# EasyEDA schematic SCH_AquaMind_2026-07-25.json
TITLE: Sheet_1; REV: 1.0; Date: 2026-07-24; Sheet: 1/1; Company: Your Company
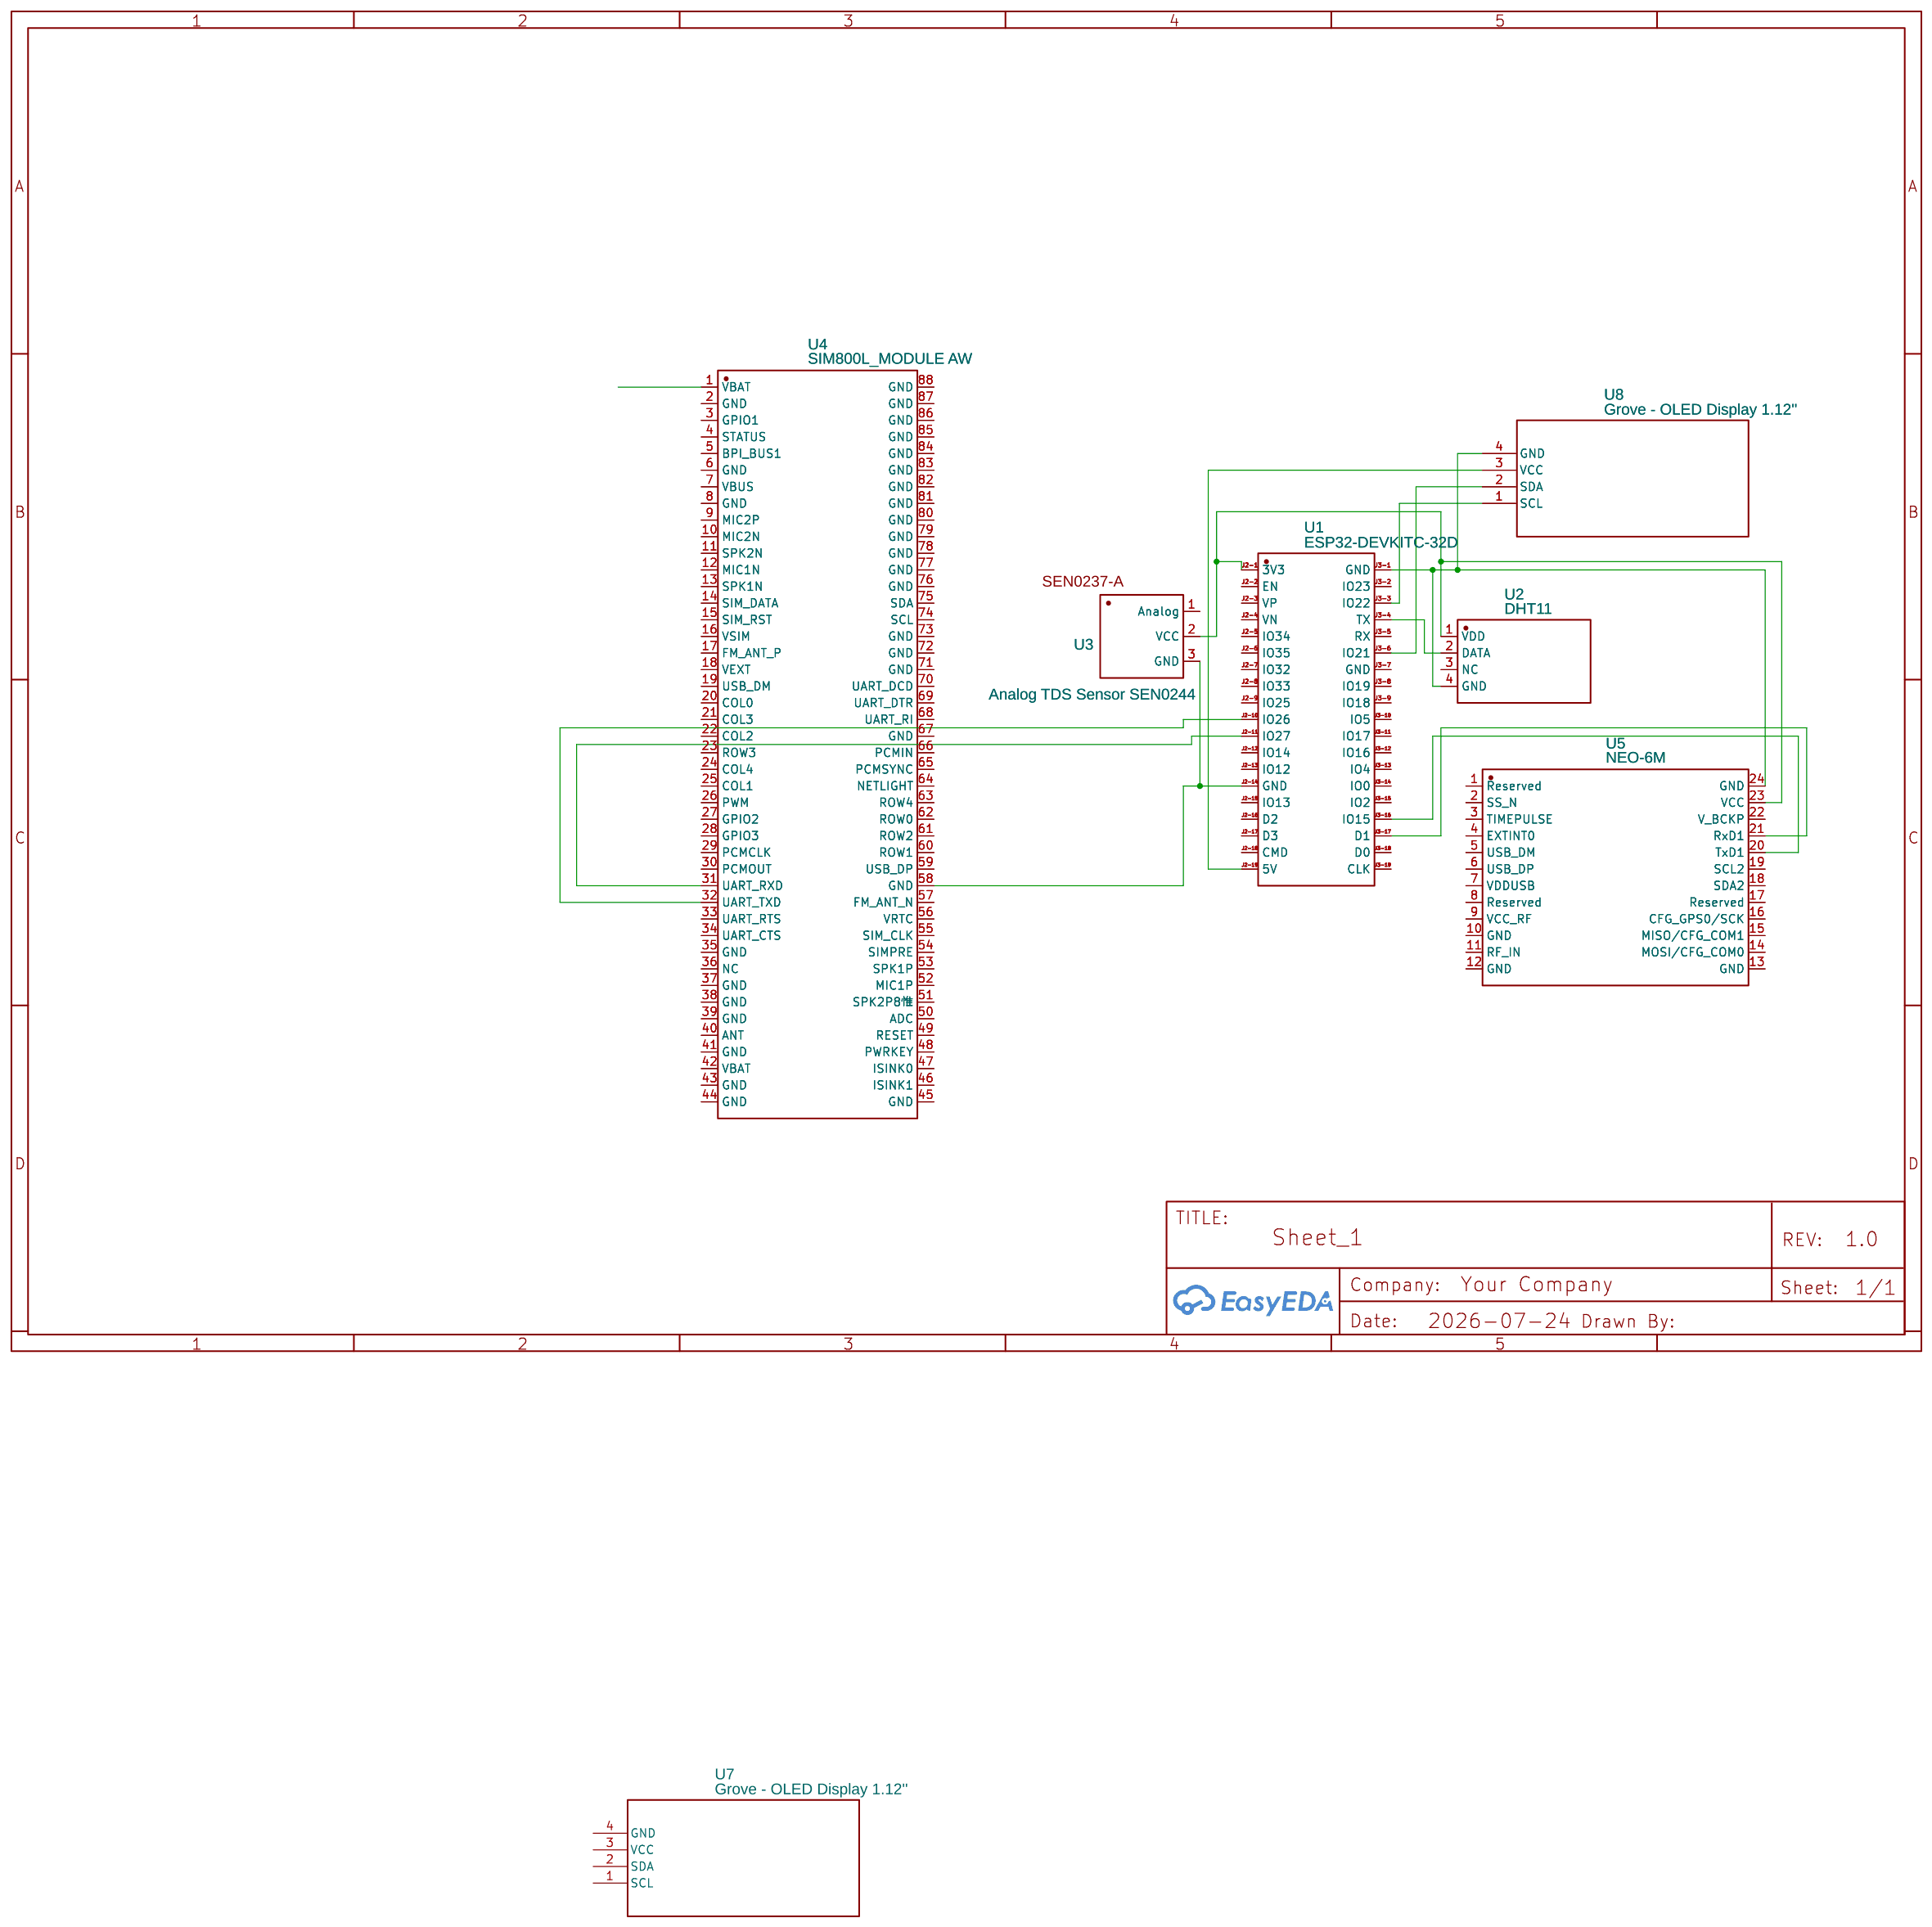
[diagram p0: schematic sheet]

## Parts
U1  ESP32-DEVKITC-32D  [COMM-SMD_ESP32-DEVKITC-32D]
U2  DHT11  [SENSOR-TH_DHT11]
U3  Analog TDS Sensor SEN0244
U4  SIM800L_MODULE AW  [GSMM-SMD_SIM800L]
U5  NEO-6M  [GPSM-SMD_24P-L16.0-W12.2-P1.10]
U7  Grove - OLED Display 1.12''  [GROVE - OLED DISPLAY 1.12'']
U8  Grove - OLED Display 1.12''  [GROVE - OLED DISPLAY 1.12'']

## Library data of the parts
U1 = ESP32-DEVKITC-32D: Supplier: LCSC; Supplier Part: C571181; Manufacturer: ESPRESSIF(乐鑫); Manufacturer Part: ESP32-DevKitC-32D; Contributor: lcsc
U2 = DHT11: Contributor: LCSC; Supplier: LCSC; Supplier Part: C117051; Manufacturer: 广州奥松; JLCPCB Part Class: Extended Part
U3 = Analog TDS Sensor SEN0244: Contributor: scholliyt
U4 = SIM800L_MODULE AW: Supplier: LCSC; Supplier Part: C9900051054; Manufacturer: null; JLCPCB Part Class: Extended Part; Contributor: lcsc
U5 = NEO-6M: Contributor: LCSC; Supplier: LCSC; Supplier Part: C2927633; Manufacturer: null; JLCPCB Part Class: Extended Part
U7 U8 = Grove - OLED Display 1.12'': sourceId: X2WQ82kCU; Supplier Part: undefined; Supplier: SeeedStudio

## Nets
Net-(U1-J2-1): U1.J2-1(3V3) U2.1(VDD) U3.2(VCC) U5.23(VCC)
Net-(U1-J2-10): U1.J2-10(IO26) U4.32(UART_TXD)
Net-(U1-J2-11): U1.J2-11(IO27) U4.31(UART_RXD)
Net-(U1-J2-14): U1.J2-14(GND) U3.3(GND) U4.58(GND)
Net-(U1-J2-19): U1.J2-19(5V) U8.3(VCC)
Net-(U1-J3-1): U1.J3-1(GND) U2.4(GND) U5.24(GND) U8.4(GND)
Net-(U1-J3-3): U1.J3-3(IO22) U8.1(SCL)
Net-(U1-J3-4): U1.J3-4(TX) U2.2(DATA)
Net-(U1-J3-6): U1.J3-6(IO21) U8.2(SDA)
Net-(U1-J3-16): U1.J3-16(IO15) U5.20(TxD1)
Net-(U1-J3-17): U1.J3-17(D1) U5.21(RxD1)

Not connected (* = marked no-connect by the designer): U1 J2-2(EN) J2-3(VP) J2-4(VN) J2-5(IO34) J2-6(IO35) J2-7(IO32) J2-8(IO33) J2-9(IO25) J2-12(IO14) J2-13(IO12) J2-15(IO13) J2-16(D2) J2-17(D3) J2-18(CMD) J3-2(IO23) J3-5(RX) J3-7(GND) J3-8(IO19) J3-9(IO18) J3-10(IO5) J3-11(IO17) J3-12(IO16) J3-13(IO4) J3-14(IO0) J3-15(IO2) J3-18(D0) J3-19(CLK); U2 3(NC); U3 1(Analog); U4 1(VBAT) 2(GND) 3(GPIO1) 4(STATUS) 5(BPI_BUS1) 6(GND) 7(VBUS) 8(GND) 9(MIC2P) 10(MIC2N) 11(SPK2N) 12(MIC1N) 13(SPK1N) 14(SIM_DATA) 15(SIM_RST) 16(VSIM) 17(FM_ANT_P) 18(VEXT) 19(USB_DM) 20(COL0) 21(COL3) 22(COL2) 23(ROW3) 24(COL4) 25(COL1) 26(PWM) 27(GPIO2) 28(GPIO3) 29(PCMCLK) 30(PCMOUT) 33(UART_RTS) 34(UART_CTS) 35(GND) 36(NC) 37(GND) 38(GND) 39(GND) 40(ANT) 41(GND) 42(VBAT) 43(GND) 44(GND) 45(GND) 46(ISINK1) 47(ISINK0) 48(PWRKEY) 49(RESET) 50(ADC) 51(SPK2P8惟) 52(MIC1P) 53(SPK1P) 54(SIMPRE) 55(SIM_CLK) 56(VRTC) 57(FM_ANT_N) 59(USB_DP) 60(ROW1) 61(ROW2) 62(ROW0) 63(ROW4) 64(NETLIGHT) 65(PCMSYNC) 66(PCMIN) 67(GND) 68(UART_RI) 69(UART_DTR) 70(UART_DCD) 71(GND) 72(GND) 73(GND) 74(SCL) 75(SDA) 76(GND) 77(GND) 78(GND) 79(GND) 80(GND) 81(GND) 82(GND) 83(GND) 84(GND) 85(GND) 86(GND) 87(GND) 88(GND); U5 1(Reserved) 2(SS_N) 3(TIMEPULSE) 4(EXTINT0) 5(USB_DM) 6(USB_DP) 7(VDDUSB) 8(Reserved) 9(VCC_RF) 10(GND) 11(RF_IN) 12(GND) 13(GND) 14(MOSI/CFG_COM0) 15(MISO/CFG_COM1) 16(CFG_GPS0/SCK) 17(Reserved) 18(SDA2) 19(SCL2) 22(V_BCKP); U7 1(SCL) 2(SDA) 3(VCC) 4(GND)
